# Altium schematic sheet 06-VIDEO_IN_ADC_2.SchDoc
size B
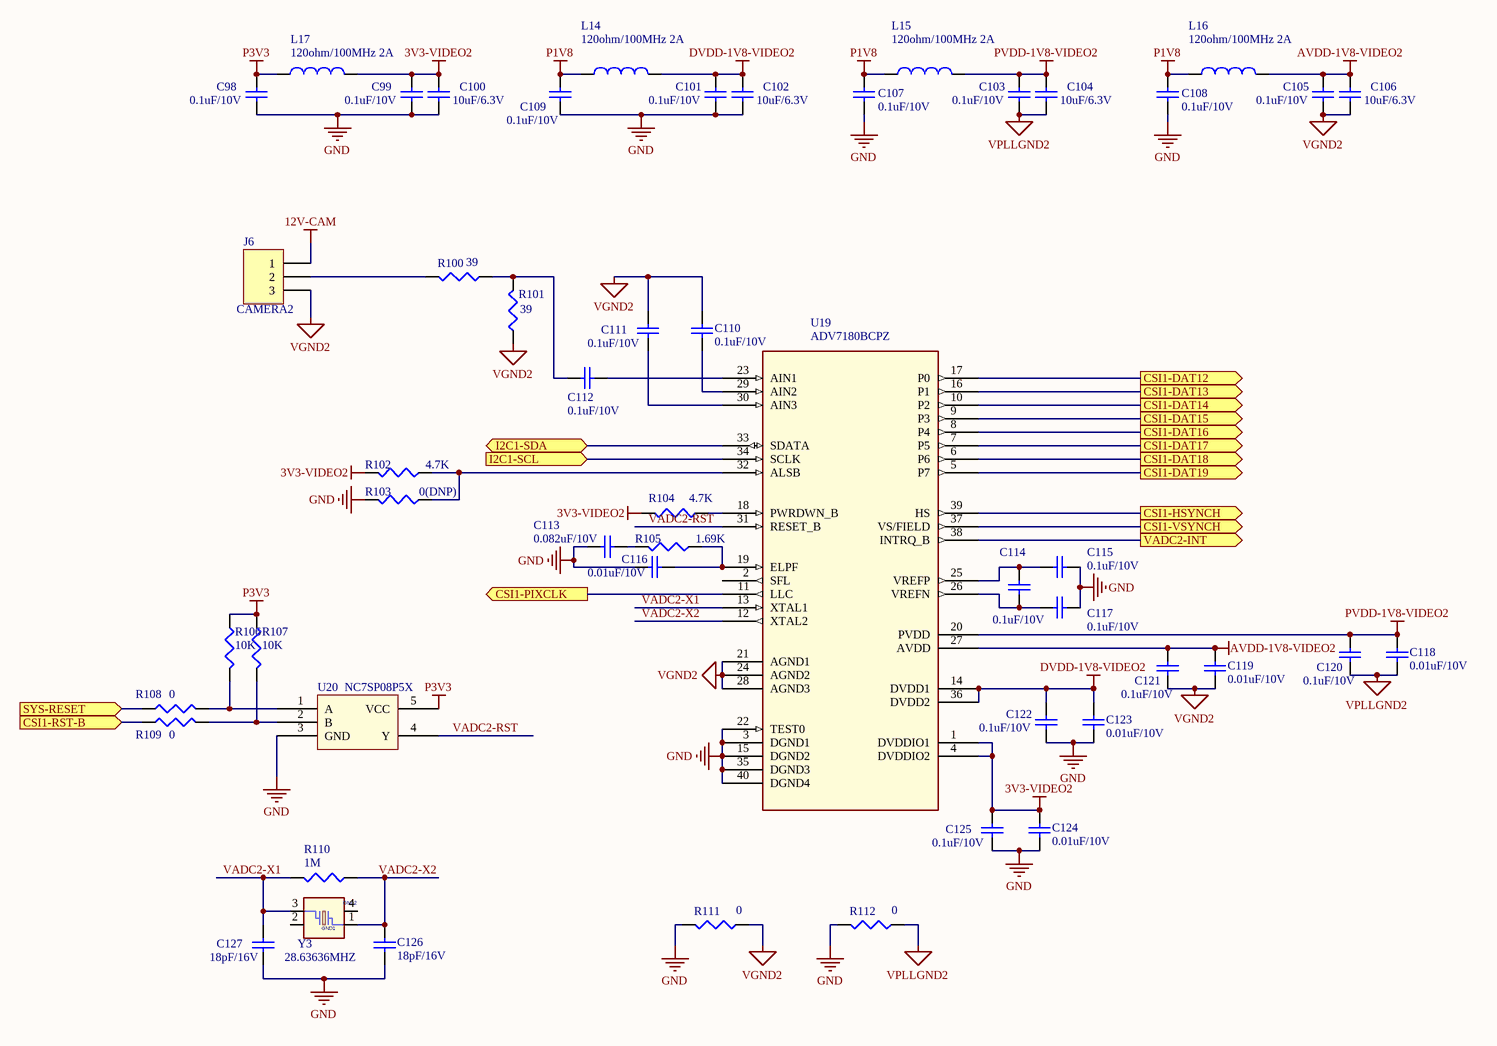
[diagram p0: 06-VIDEO_IN_ADC_2.SchDoc]

## Parts
C98  0.1uF/10V  [0402]
C99  0.1uF/10V  [0402]
C100  10uF/6.3V  [0805]
C101  0.1uF/10V  [0402]
C102  10uF/6.3V  [0805]
C103  0.1uF/10V  [0402]
C104  10uF/6.3V  [0805]
C105  0.1uF/10V  [0402]
C106  10uF/6.3V  [0805]
C107  0.1uF/10V  [0402]
C108  0.1uF/10V  [0402]
C109  0.1uF/10V  [0402]
C110  0.1uF/10V  [0402]
C111  0.1uF/10V  [0402]
C112  0.1uF/10V  [0402]
C113  0.082uF/10V  [0402]
C114  0.1uF/10V  [0402]
C115  0.1uF/10V  [0402]
C116  0.01uF/10V  [0402]
C117  0.1uF/10V  [0402]
C118  0.01uF/10V  [0402]
C119  0.01uF/10V  [0402]
C120  0.1uF/10V  [0402]
C121  0.1uF/10V  [0402]
C122  0.1uF/10V  [0402]
C123  0.01uF/10V  [0402]
C124  0.01uF/10V  [0402]
C125  0.1uF/10V  [0402]
C126  18pF/16V  [0402]
C127  18pF/16V  [0402]
J6  CAMERA2  [CONN-3P]
L14  120ohm/100MHz 2A  [0603]
L15  120ohm/100MHz 2A  [0603]
L16  120ohm/100MHz 2A  [0603]
L17  120ohm/100MHz 2A  [0603]
R100  39  [0402]
R101  39  [0402]
R102  4.7K  [0402]
R103  0(DNP)  [0402]
R104  4.7K  [0402]
R105  1.69K  [0402]
R106  10K  [0402]
R107  10K  [0402]
R108  0  [0402]
R109  0  [0402]
R110  1M  [0402]
R111  0  [0402]
R112  0  [0402]
U19  ADV7180BCPZ  [LFCSP40]
U20  NC7SP08P5X  [SC70]
Y3  28.63636MHZ  [XTAL4_SX_3225]

## Ports
CSI1-DAT12 (out), CSI1-DAT13 (out), CSI1-DAT14 (out), CSI1-DAT15 (out), CSI1-DAT16 (out), CSI1-DAT17 (out), CSI1-DAT18 (out), CSI1-DAT19 (out), CSI1-HSYNCH (out), CSI1-PIXCLK (out), CSI1-RST-B (in), CSI1-VSYNCH (out), I2C1-SCL (in), I2C1-SDA (bidir), SYS-RESET (in), VADC2-INT (out)

## Nets
3V3-VIDEO2: C99.1 C100.1 C124.2 C125.2 L17.2 R102.2 R104.2 U19.1(DVDDIO1) U19.4(DVDDIO2)
12V-CAM: J6.1
AVDD-1V8-VIDEO2: C105.1 C106.1 C119.2 C121.2 L16.2 U19.27(AVDD)
DVDD-1V8-VIDEO2: C101.1 C102.1 C122.2 C123.2 L14.2 U19.14(DVDD1) U19.36(DVDD2)
GND: C98.2 C99.2 C100.2 C101.2 C102.2 C107.2 C108.2 C109.2 C113.1 C115.1 C116.1 C117.2 C122.1 C123.1 C124.1 C125.1 C126.1 C127.1 R103.2 R111.2 R112.2 U19.3(DGND1) U19.15(DGND2) U19.22(TEST0) U19.35(DGND3) U19.40(DGND4) U20.3(GND)
P1V8: C107.1 C108.1 C109.1 L14.1 L15.1 L16.1
P3V3: C98.1 L17.1 R106.1 R107.1 U20.5(VCC)
PVDD-1V8-VIDEO2: C103.1 C104.1 C118.2 C120.2 L15.2 U19.20(PVDD)
VGND2: C105.2 C106.2 C110.2 C111.2 C119.1 C121.1 J6.3 R101.1 R111.1 U19.21(AGND1) U19.24(AGND2) U19.28(AGND3)
VPLLGND2: C103.2 C104.2 C118.1 C120.1 R112.1
CSI1-DAT12: U19.17(P0) ; port CSI1-DAT12
CSI1-DAT13: U19.16(P1) ; port CSI1-DAT13
CSI1-DAT14: U19.10(P2) ; port CSI1-DAT14
CSI1-DAT15: U19.9(P3) ; port CSI1-DAT15
CSI1-DAT16: U19.8(P4) ; port CSI1-DAT16
CSI1-DAT17: U19.7(P5) ; port CSI1-DAT17
CSI1-DAT18: U19.6(P6) ; port CSI1-DAT18
CSI1-DAT19: U19.5(P7) ; port CSI1-DAT19
CSI1-HSYNCH: U19.39(HS) ; port CSI1-HSYNCH
CSI1-PIXCLK: U19.11(LLC) ; port CSI1-PIXCLK
CSI1-RST-B: R109.1 ; port CSI1-RST-B
CSI1-VSYNCH: U19.37(VS/FIELD) ; port CSI1-VSYNCH
I2C1-SCL: U19.34(SCLK) ; port I2C1-SCL
I2C1-SDA: U19.33(SDATA) ; port I2C1-SDA
SYS-RESET: R108.1 ; port SYS-RESET
VADC2-INT: U19.38(INTRQ_B) ; port VADC2-INT
VADC2-RST: U19.31(RESET_B) U20.4(Y)
VADC2-X1: C127.2 R110.2 U19.13(XTAL1) Y3.3
VADC2-X2: C126.2 R110.1 U19.12(XTAL2) Y3.1
NetC110_1: C110.1 U19.29(AIN2)
NetC111_1: C111.1 U19.30(AIN3)
NetC112_1: C112.1 R100.1 R101.2
NetC112_2: C112.2 U19.23(AIN1)
NetC113_2: C113.2 R105.2
NetC114_1: C114.1 C117.1 U19.26(VREFN)
NetC114_2: C114.2 C115.2 U19.25(VREFP)
NetC116_2: C116.2 R105.1 U19.19(ELPF)
NetJ6_2: J6.2 R100.2
NetR102_1: R102.1 R103.1 U19.32(ALSB)
NetR104_1: R104.1 U19.18(PWRDWN_B)
NetR106_2: R106.2 R108.2 U20.1(A)
NetR107_2: R107.2 R109.2 U20.2(B)

Not connected (* = marked no-connect by the designer): U19 2(SFL); Y3 2(GND1) 4(GND2)

## Library data of the parts
C98-C127 = Cap: Capacitor; Published: 8-Jun-2000; LatestRevisionDate: 17-Jul-2002; LatestRevisionNote: Re-released for DXP Platform.; PackageReference: RAD-0.3; Publisher: Altium Limited; PackageDescription: Radial Cap, Thru-Hole; 2 Leads; 0.3 in Pin Spacing
J6 = Header 3: Header, 3-Pin; LatestRevisionDate: 17-Jul-2002; LatestRevisionNote: Re-released for DXP Platform.; Publisher: Altium Limited
L14-L17 = Inductor: Code_IEC: 1005; Value: 300ohm/100MHz BEAD; Published: 8-Jun-2000; LatestRevisionDate: 29-May-2009; LatestRevisionNote: IPC-7351 Footprint Added.; PackageReference: 0402-A; Publisher: Altium Limited; PackageDescription: Chip Inductor; Code_JEITA: 0402
R100-R112 = CR16-1003FM
U19 = ADV7180BCPZ: CLASS: IC
Y3 = CRYSTAL_JXS63: XTAL 28.63636MHZ 10PF RSN -- SMT; CLASS: IC; PRIORITY_PN: 048-00268; CAD_APPROVED: Yes; MFG_PN01: ABM3B-28.63636MHZ-10-1-U-T; MFG_NAME01: ABRACON CORP; AGILE_PN: 230-76635; HEIGHT: 1.1MM; ROHS: Yes